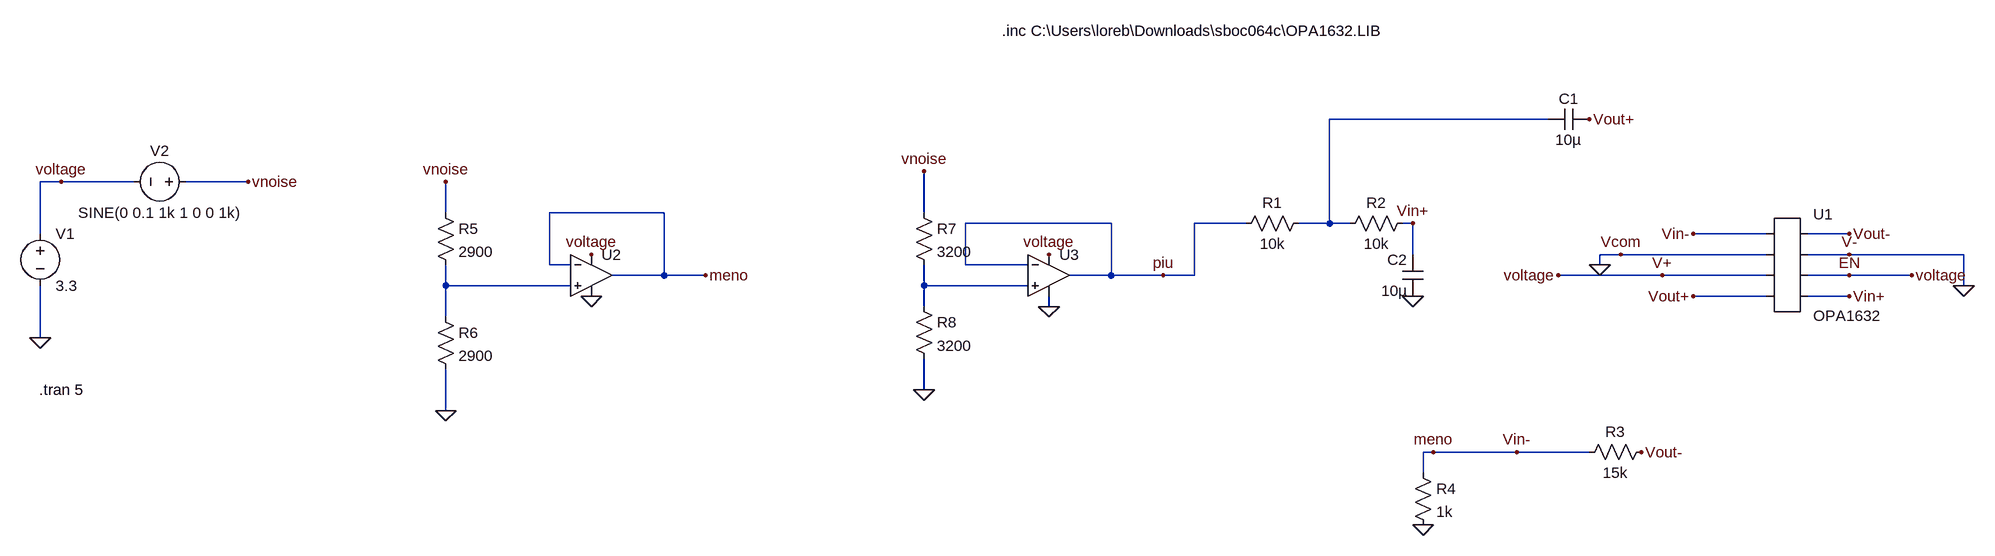
[diagram p0: schematic Draft3.asc]
Draft3.asc, the LTspice schematic file:
Version 4
SHEET 1 880 776
WIRE 128 112 -208 112
WIRE -2160 208 -2192 208
WIRE -2048 208 -2160 208
WIRE -1872 208 -1968 208
WIRE -1568 256 -1568 208
WIRE -1232 256 -1408 256
WIRE -832 256 -832 192
WIRE -544 272 -768 272
WIRE -336 272 -416 272
WIRE -208 272 -208 112
WIRE -208 272 -256 272
WIRE -176 272 -208 272
WIRE -80 272 -96 272
WIRE -2192 288 -2192 208
WIRE 464 288 352 288
WIRE 592 288 528 288
WIRE -80 320 -80 272
WIRE 240 320 208 320
WIRE 464 320 240 320
WIRE 592 320 528 320
WIRE 768 320 592 320
WIRE -1408 336 -1408 256
WIRE -1376 336 -1408 336
WIRE -768 336 -768 272
WIRE -672 336 -768 336
WIRE 208 336 208 320
WIRE -1232 352 -1232 256
WIRE -1232 352 -1312 352
WIRE -1168 352 -1232 352
WIRE -544 352 -544 272
WIRE -544 352 -608 352
WIRE -464 352 -544 352
WIRE -416 352 -416 272
WIRE -416 352 -464 352
WIRE 304 352 144 352
WIRE 464 352 304 352
WIRE 592 352 528 352
WIRE 688 352 592 352
WIRE -1568 368 -1568 336
WIRE -1376 368 -1568 368
WIRE -832 368 -832 336
WIRE -672 368 -832 368
WIRE 768 368 768 320
WIRE 464 384 352 384
WIRE 592 384 528 384
WIRE -832 400 -832 368
WIRE -640 400 -640 384
WIRE -1568 416 -1568 368
WIRE -2192 448 -2192 368
WIRE -832 528 -832 480
WIRE -1568 560 -1568 496
WIRE -48 624 -64 624
WIRE 80 624 -48 624
WIRE 192 624 80 624
WIRE -64 656 -64 624
FLAG 352 288 Vin-
FLAG 352 384 Vout+
FLAG 592 288 Vout-
FLAG 592 320 V-
FLAG 592 352 EN
FLAG 592 384 Vin+
FLAG 80 624 Vin-
FLAG -64 736 0
FLAG 272 624 Vout-
FLAG 192 112 Vout+
FLAG -80 272 Vin+
FLAG -80 384 0
FLAG -832 528 0
FLAG -1568 560 0
FLAG -2192 448 0
FLAG -2160 208 voltage
FLAG -1872 208 vnoise
FLAG -1344 384 0
FLAG -640 400 0
FLAG -1568 208 vnoise
FLAG -832 192 vnoise
FLAG -1344 320 voltage
FLAG -640 320 voltage
FLAG 144 352 voltage
FLAG 768 368 0
FLAG 208 336 0
FLAG 240 320 Vcom
FLAG 304 352 V+
FLAG 688 352 voltage
FLAG -464 352 piu
FLAG -1168 352 meno
FLAG -48 624 meno
SYMBOL AutoGenerated\\OPA1632 496 336 R0
SYMATTR InstName U1
SYMBOL res -240 256 R90
WINDOW 0 0 56 VBottom 2
WINDOW 3 32 56 VTop 2
SYMATTR InstName R1
SYMATTR Value 10k
SYMBOL res -80 256 R90
WINDOW 0 0 56 VBottom 2
WINDOW 3 32 56 VTop 2
SYMATTR InstName R2
SYMATTR Value 10k
SYMBOL cap 192 96 R90
WINDOW 0 0 32 VBottom 2
WINDOW 3 32 32 VTop 2
SYMATTR InstName C1
SYMATTR Value 10µ
SYMBOL cap -64 384 R180
WINDOW 0 24 56 Left 2
WINDOW 3 24 8 Left 2
SYMATTR InstName C2
SYMATTR Value 10µ
SYMBOL res 288 608 R90
WINDOW 0 0 56 VBottom 2
WINDOW 3 32 56 VTop 2
SYMATTR InstName R3
SYMATTR Value 15k
SYMBOL res -80 640 R0
SYMATTR InstName R4
SYMATTR Value 1k
SYMBOL res -1584 240 R0
SYMATTR InstName R5
SYMATTR Value 2900
SYMBOL res -1584 400 R0
SYMATTR InstName R6
SYMATTR Value 2900
SYMBOL res -848 240 R0
SYMATTR InstName R7
SYMATTR Value 3200
SYMBOL res -848 384 R0
SYMATTR InstName R8
SYMATTR Value 3200
SYMBOL OpAmps\\UniversalOpAmp2 -1344 352 R0
SYMATTR InstName U2
SYMBOL OpAmps\\UniversalOpAmp2 -640 352 R0
SYMATTR InstName U3
SYMBOL voltage -2192 272 R0
WINDOW 123 0 0 Left 0
WINDOW 39 0 0 Left 0
SYMATTR InstName V1
SYMATTR Value 3.3
SYMBOL voltage -1952 208 R90
WINDOW 0 -32 56 VBottom 2
WINDOW 3 32 56 VTop 2
WINDOW 123 0 0 Left 0
WINDOW 39 0 0 Left 0
SYMATTR InstName V2
SYMATTR Value SINE(0 0.1 1k 1 0 0 1k)
TEXT -712 -24 Left 2 !.inc C:\\Users\\loreb\\Downloads\\sboc064c\\OPA1632.LIB
TEXT -2194 528 Left 2 !.tran 5

The netlist it stands for:
* Draft3.asc
* U1: OPA1632 (symbol AutoGenerated\OPA1632 not available, pins judged from their places): pin1=meno pin2=0 pin3=V+ pin4=Vout+ pin5=Vout- pin6=0 pin7=V+ pin8=Vin+
R1 N001 piu 10k
R2 Vin+ N001 10k
C1 Vout+ N001 10µ
C2 0 Vin+ 10µ
R3 Vout- meno 15k
R4 meno 0 1k
R5 vnoise N002 2900
R6 N002 0 2900
R7 vnoise N003 3200
R8 N003 0 3200
XU2 N002 meno V+ 0 meno level2 Avol=1Meg GBW=10Meg Slew=10Meg Ilimit=25m Rail=0 Vos=0 En=0 Enk=0 In=0 Ink=0 Rin=500Meg  ; pins In+ In- V+ V- OUT
XU3 N003 piu V+ 0 piu level2 Avol=1Meg GBW=10Meg Slew=10Meg Ilimit=25m Rail=0 Vos=0 En=0 Enk=0 In=0 Ink=0 Rin=500Meg  ; pins In+ In- V+ V- OUT
V1 V+ 0 3.3
V2 vnoise V+ SINE(0 0.1 1k 1 0 0 1k)
.inc C:\Users\loreb\Downloads\sboc064c\OPA1632.LIB
.tran 5
.lib UniversalOpAmp2.lib
.backanno
.end